# EAGLE schematic HeaderConnectorBoard (EAGLE 7.6.0)
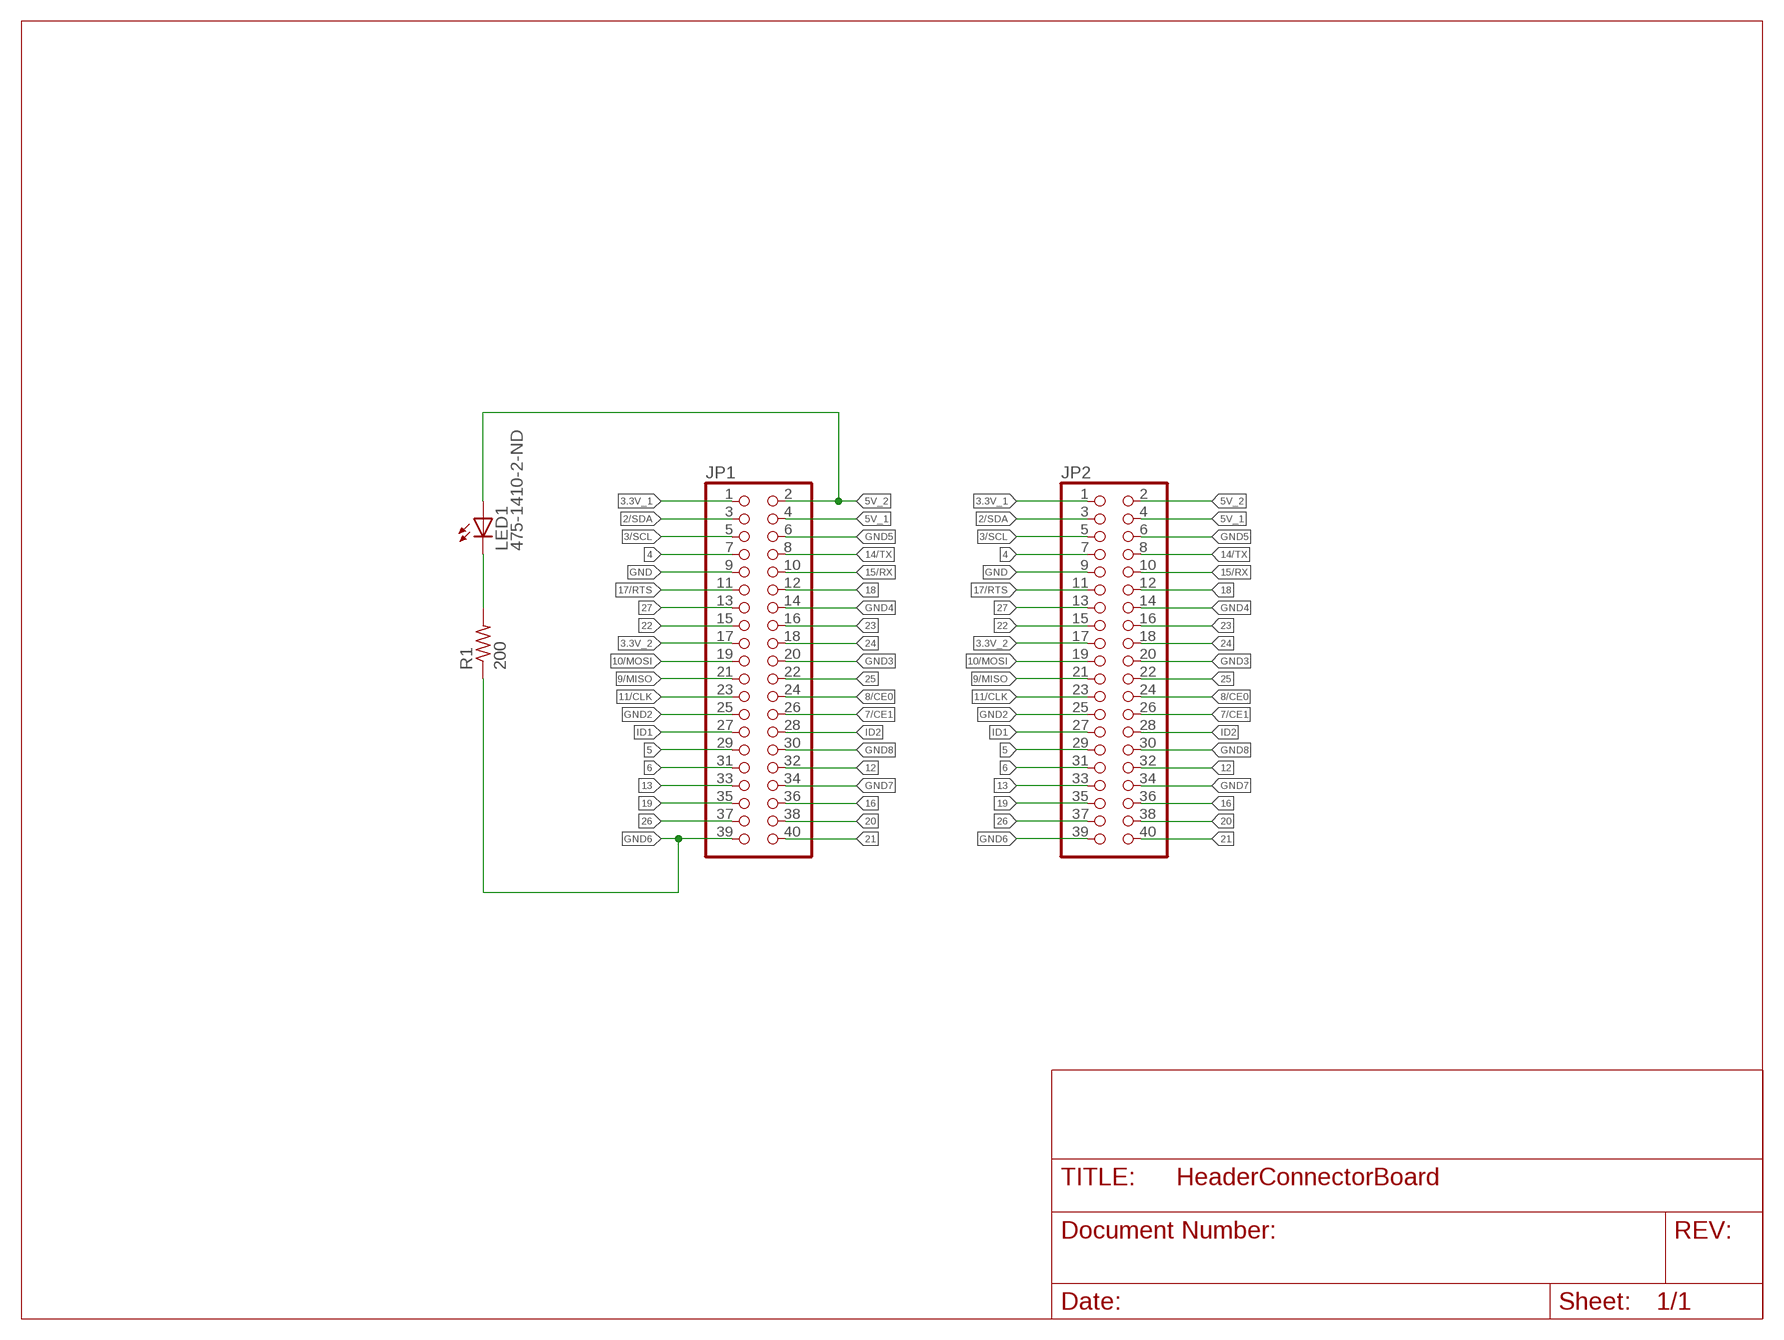
[diagram p0: schematic, sheet 1]

## Parts
JP1  PINHD-2X20  [2X20]
JP2  PINHD-2X20  [2X20]
LED1  475-1410-2-ND  LEDCHIPLED_0805  [CHIPLED_0805]
R1  200  R-US_R0805  [R0805]

## Nets
2/SDA: JP1.3 JP2.3
3.3V_1: JP1.1 JP2.1
3.3V_2: JP1.17 JP2.17
3/SCL: JP1.5 JP2.5
4: JP1.7 JP2.7
5: JP1.29 JP2.29
5V_1: JP1.4 JP2.4
5V_2: JP1.2 JP2.2 LED1.A
6: JP1.31 JP2.31
7/CE1: JP1.26 JP2.26
8/CE0: JP1.24 JP2.24
9/MISO: JP1.21 JP2.21
10/MOSI: JP1.19 JP2.19
11/CLK: JP1.23 JP2.23
12: JP1.32 JP2.32
13: JP1.33 JP2.33
14/TX: JP1.8 JP2.8
15/RX: JP1.10 JP2.10
16: JP1.36 JP2.36
17/RTS: JP1.11 JP2.11
18: JP1.12 JP2.12
19: JP1.35 JP2.35
20: JP1.38 JP2.38
21: JP1.40 JP2.40
22: JP1.15 JP2.15
23: JP1.16 JP2.16
24: JP1.18 JP2.18
25: JP1.22 JP2.22
26: JP1.37 JP2.37
27: JP1.13 JP2.13
GND: JP1.9 JP2.9
GND2: JP1.25 JP2.25
GND3: JP1.20 JP2.20
GND4: JP1.14 JP2.14
GND5: JP1.6 JP2.6
GND6: JP1.39 JP2.39 R1.1
GND7: JP1.34 JP2.34
GND8: JP1.30 JP2.30
ID1: JP1.27 JP2.27
ID2: JP1.28 JP2.28
N$1: LED1.C R1.2

## Library data of the parts
JP1 JP2 = HeaderConnectorBoard:PINHD-2X20: PIN HEADER
LED1 = led:LED: LED OSRAM: - CHIPLED LG R971, LG N971, LY N971, LG Q971, LY Q971, LO R971, LY R971 LH N974, LH R974 LS Q976, LO Q976, LY Q976 LO Q996 - Hyper CHIPLED LW Q18S LB Q993, LB Q99A, LB R99A - SideLED LS A670, LO A670, LY A670, LG A670, LP A670 LB A673, LV A673, LT A673, LW A673 LH A674 LY A675 LS A676, LA A676, LO A676, LY A676, LW A676 LS A679, LY A679, LG A679 - Hyper Micro SIDELED® LS Y876, LA Y876, LO Y876, LY Y876 LT Y87S - SmartLED LW L88C, LW L88S LB L89C, LB L89S, LG L890 LS L89K, LO L89K, LY L89K LS L896, LA L896, LO L896, LY L896 - TOPLED LS T670, LO T670, LY T670, LG T670, LP T670 LSG T670, LSP T670, LSY T670, LOP T670, LYG T670 LG T671, LOG T671, LSG T671 LB T673, LV T673, LT T673, LW T673 LH T674 LS T676, LA T676, LO T676, LY T676, LB T676, LH T676, LSB T676, LW T676 LB T67C, LV T67C, LT T67C, LS T67K, LO T67K, LY T67K, LW E67C LS E67B, LA E67B, LO E67B, LY E67B, LB E67C, LV E67C, LT E67C LW T67C LS T679, LY T679, LG T679 LS T770, LO T770, LY T770, LG T770, LP T770 LB T773, LV T773, LT T773, LW T773 LH T774 LS E675, LA E675, LY E675, LS T675 LS T776, LA T776, LO T776, LY T776, LB T776 LHGB T686 LT T68C, LB T68C - Hyper Mini TOPLED® LB M676 - Mini TOPLED Santana® LG M470 LS M47K, LO M47K, LY M47K Source: http://www.osram.convergy.de LUXEON: - LUMILED® LXK2-PW12-R00, LXK2-PW12-S00, LXK2-PW14-U00, LXK2-PW14-V00 LXK2-PM12-R00, LXK2-PM12-S00, LXK2-PM14-U00 LXK2-PE12-Q00, LXK2-PE12-R00, LXK2-PE12-S00, LXK2-PE14-T00, LXK2-PE14-U00 LXK2-PB12-K00, LXK2-PB12-L00, LXK2-PB12-M00, LXK2-PB14-N00, LXK2-PB14-P00, LXK2-PB14-Q00 LXK2-PR12-L00, LXK2-PR12-M00, LXK2-PR14-Q00, LXK2-PR14-R00 LXK2-PD12-Q00, LXK2-PD12-R00, LXK2-PD12-S00 LXK2-PH12-R00, LXK2-PH12-S00 LXK2-PL12-P00, LXK2-PL12-Q00, LXK2-PL12-R00 Source: www.luxeon.com KINGBRIGHT: KA-3528ASYC Source: www.kingbright.com
R1 = resistor:R-US_: RESISTOR, American symbol